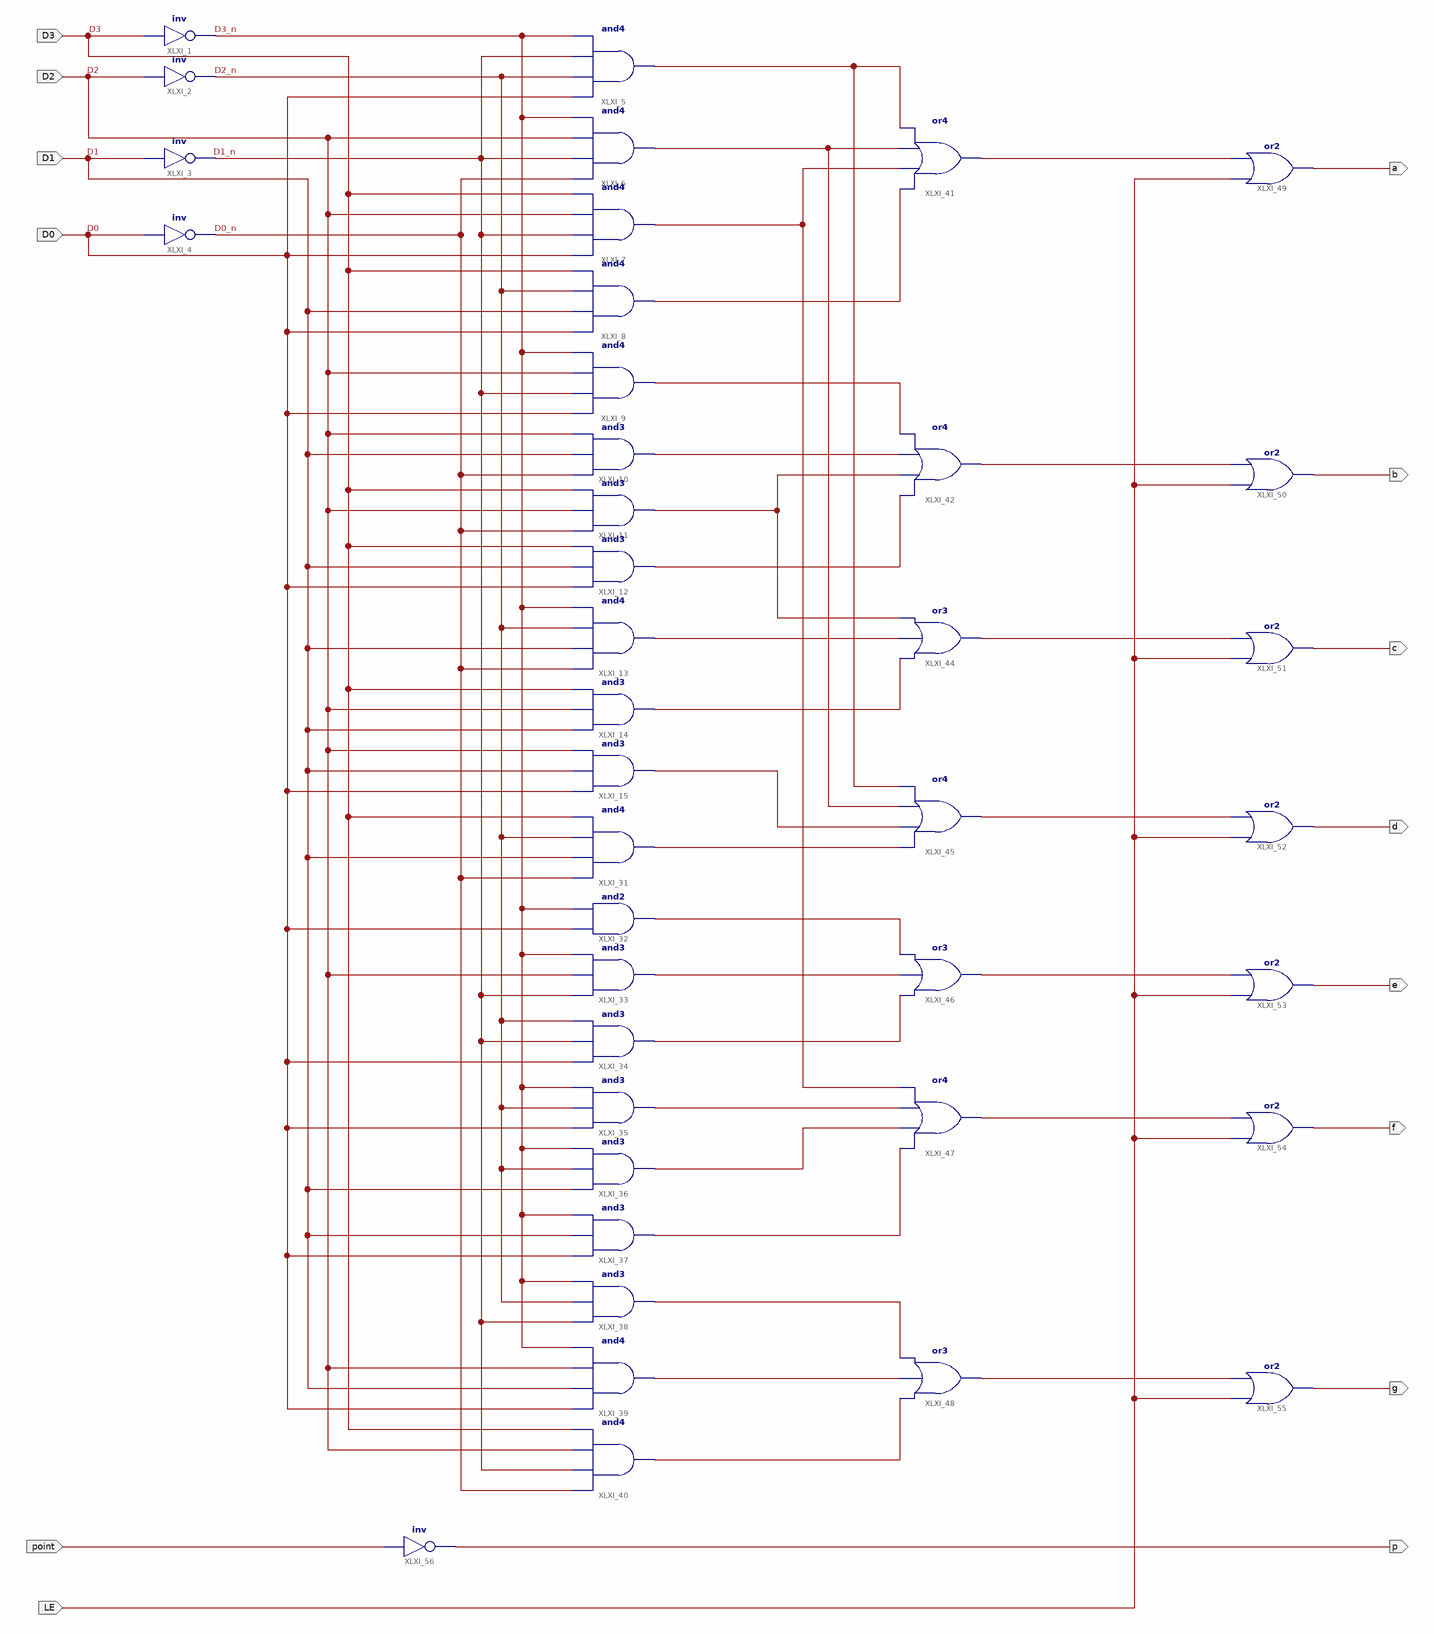
[diagram p0: schematic sheet 1]
// Xilinx ISE schematic MyMC14495.sch (kintex7) as structural Verilog: 40 symbols, 14 ports
module MyMC14495 (
  input  D3,
  input  D1,
  input  D2,
  input  D0,
  input  LE,
  input  point,
  output p,
  output g,
  output f,
  output e,
  output d,
  output c,
  output b,
  output a
);

  wire D0_n, D1_n, D2_n, D3_n, XLXN_17, XLXN_18, XLXN_19, XLXN_20, XLXN_21, XLXN_22, XLXN_24, XLXN_25,
       XLXN_26, XLXN_28, XLXN_29, XLXN_30, XLXN_32, XLXN_33, XLXN_34, XLXN_35, XLXN_36, XLXN_37, XLXN_38,
       XLXN_39, XLXN_40, XLXN_41, XLXN_42, XLXN_43, XLXN_44, XLXN_45, XLXN_46, XLXN_48;

  and XLXI_5 (XLXN_24, D0, D2_n, D1_n, D3_n);
  and XLXI_6 (XLXN_25, D0_n, D1_n, D2, D3_n);
  and XLXI_7 (XLXN_26, D0, D1_n, D2, D3);
  and XLXI_8 (XLXN_28, D0, D1, D2_n, D3);
  and XLXI_9 (XLXN_29, D0, D1_n, D2, D3_n);
  and XLXI_10 (XLXN_17, D0_n, D1, D2);
  and XLXI_11 (XLXN_30, D0_n, D2, D3);
  and XLXI_12 (XLXN_32, D0, D1, D3);
  and XLXI_13 (XLXN_18, D0_n, D1, D2_n, D3_n);
  and XLXI_14 (XLXN_33, D1, D2, D3);
  and XLXI_15 (XLXN_34, D0, D1, D2);
  not XLXI_1 (D3_n, D3);
  not XLXI_2 (D2_n, D2);
  not XLXI_3 (D1_n, D1);
  not XLXI_4 (D0_n, D0);
  and XLXI_31 (XLXN_19, D0_n, D1, D2_n, D3);
  and XLXI_32 (XLXN_35, D0, D3_n);
  and XLXI_33 (XLXN_20, D1_n, D2, D3_n);
  and XLXI_34 (XLXN_36, D0, D1_n, D2_n);
  and XLXI_35 (XLXN_21, D0, D2_n, D3_n);
  and XLXI_36 (XLXN_37, D1, D2_n, D3_n);
  and XLXI_37 (XLXN_38, D0, D1, D3_n);
  and XLXI_38 (XLXN_39, D1_n, D2_n, D3_n);
  and XLXI_39 (XLXN_22, D0, D1, D2, D3_n);
  and XLXI_40 (XLXN_40, D0_n, D1_n, D2, D3);
  or XLXI_41 (XLXN_41, XLXN_28, XLXN_26, XLXN_25, XLXN_24);
  or XLXI_42 (XLXN_42, XLXN_32, XLXN_30, XLXN_17, XLXN_29);
  or XLXI_44 (XLXN_43, XLXN_33, XLXN_18, XLXN_30);
  or XLXI_45 (XLXN_44, XLXN_19, XLXN_34, XLXN_25, XLXN_24);
  or XLXI_46 (XLXN_45, XLXN_36, XLXN_20, XLXN_35);
  or XLXI_47 (XLXN_46, XLXN_38, XLXN_37, XLXN_21, XLXN_26);
  or XLXI_48 (XLXN_48, XLXN_40, XLXN_22, XLXN_39);
  or XLXI_49 (a, LE, XLXN_41);
  or XLXI_50 (b, LE, XLXN_42);
  or XLXI_51 (c, LE, XLXN_43);
  or XLXI_52 (d, LE, XLXN_44);
  or XLXI_53 (e, LE, XLXN_45);
  or XLXI_54 (f, LE, XLXN_46);
  or XLXI_55 (g, LE, XLXN_48);
  not XLXI_56 (p, point);
endmodule
